# Altium schematic sheet mcu.SchDoc
size A3; SheetNumber: 5; SheetTotal: 5
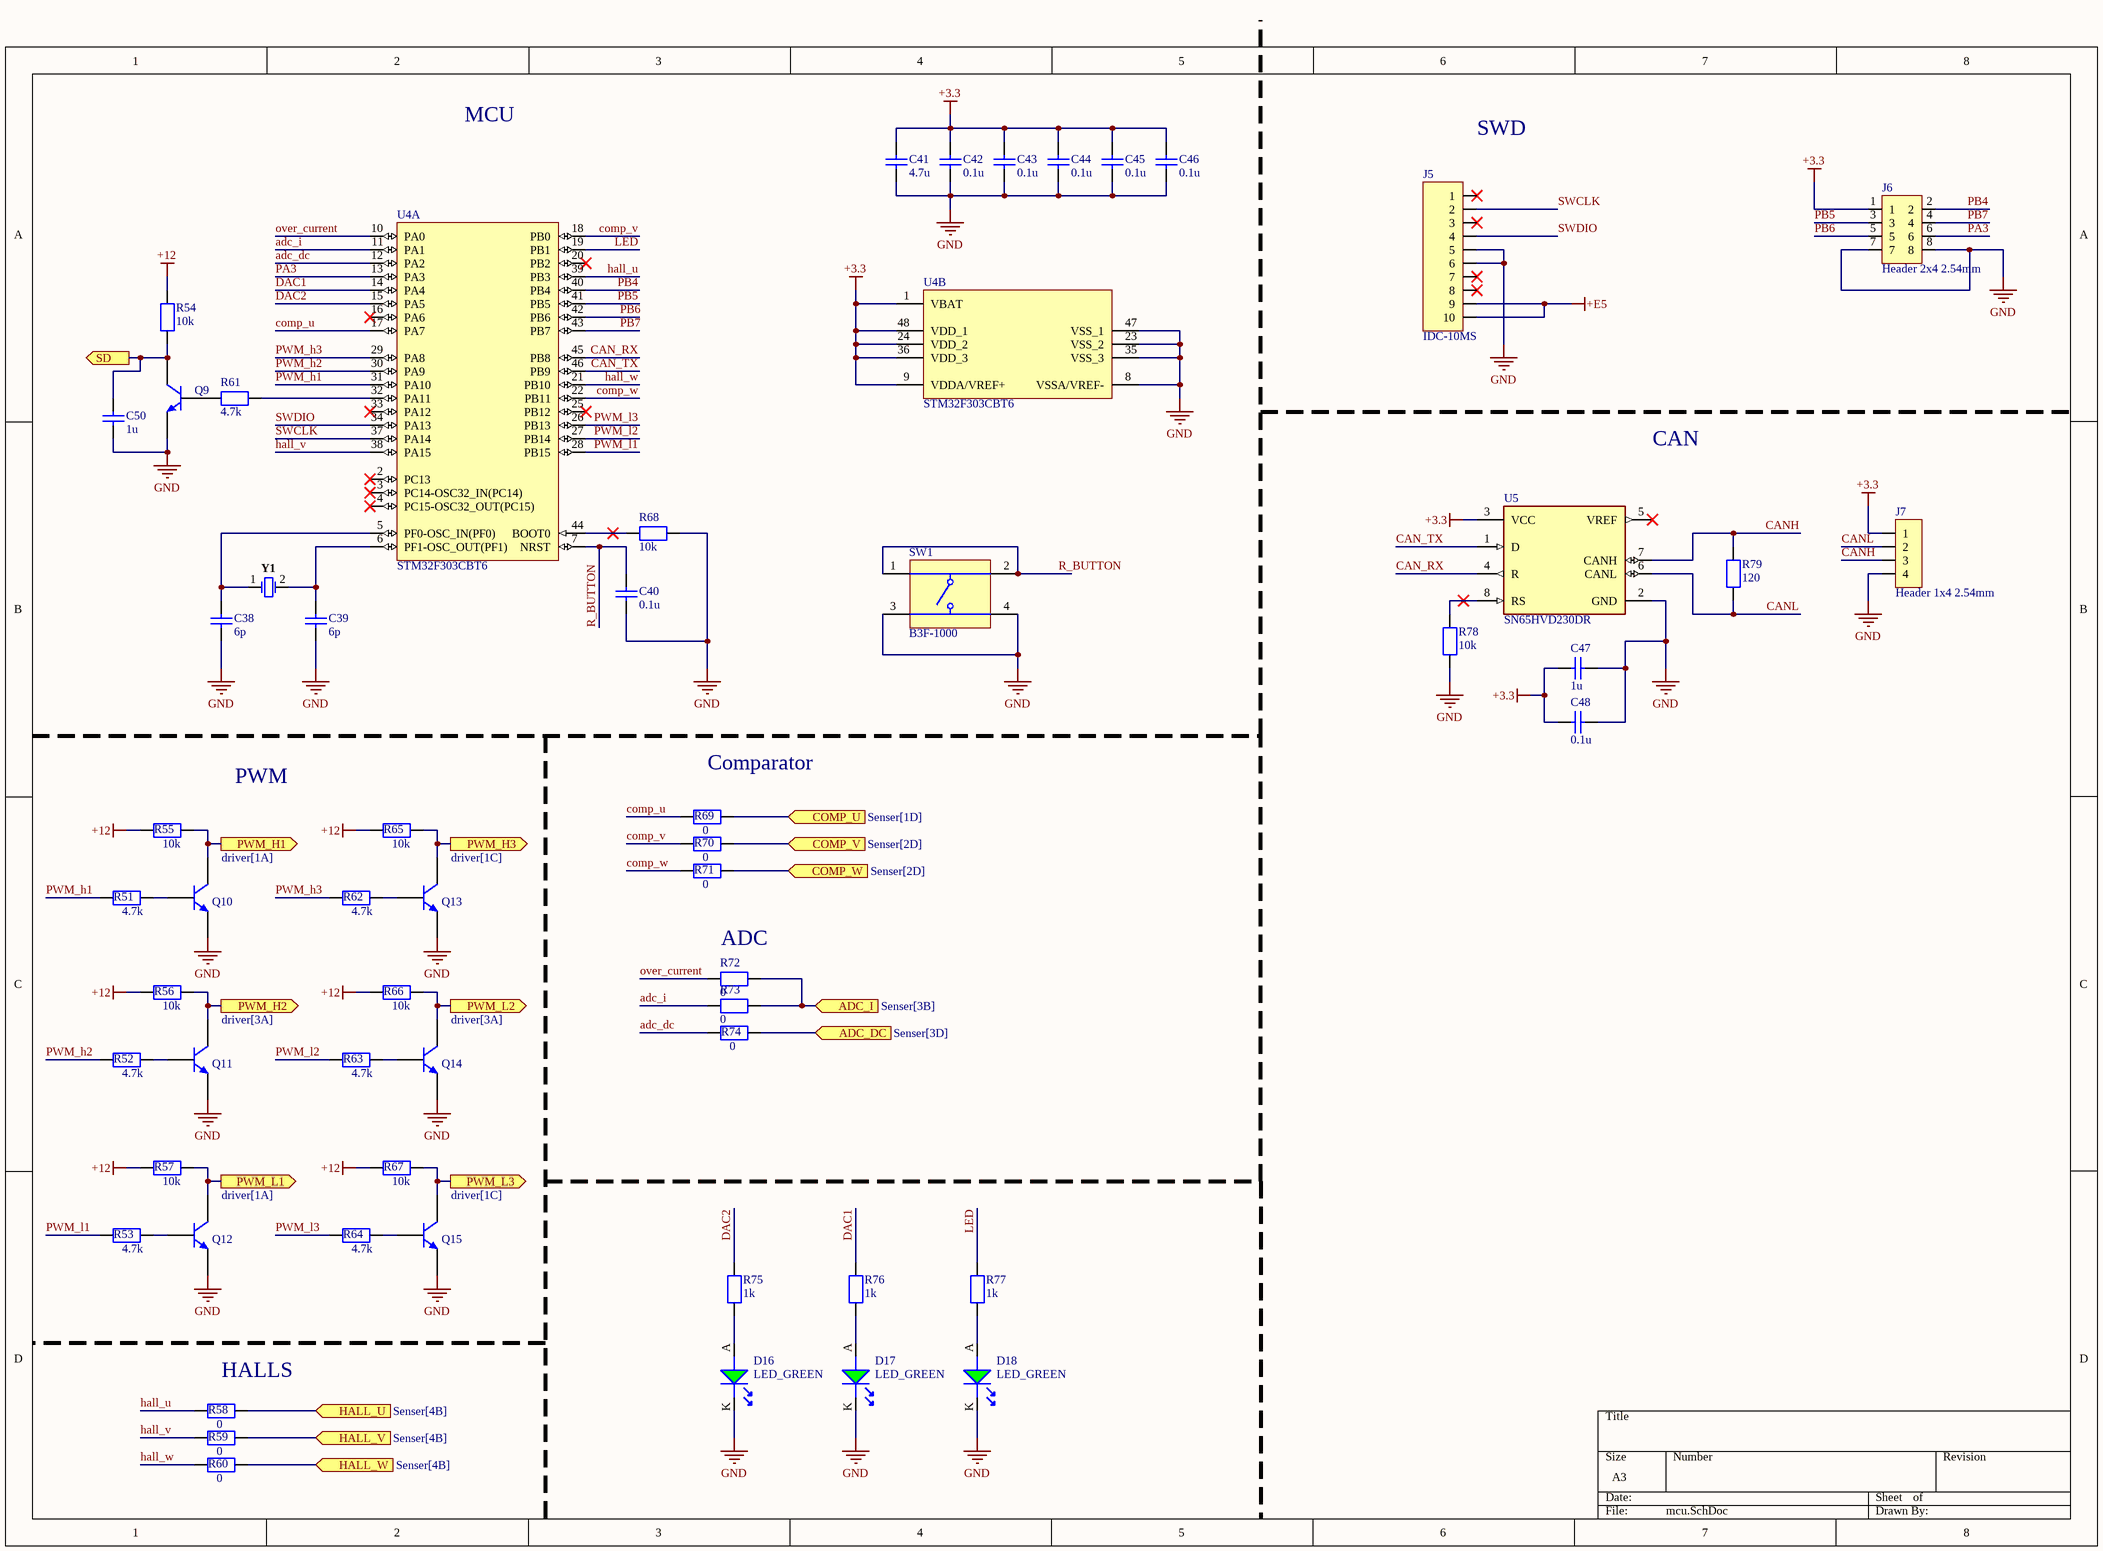
[diagram p0: mcu.SchDoc]

## Parts
C38  value 6p  [CAPC2012X06N]  (hidden comment: CAP)
C39  value 6p  [CAPC2012X06N]  (hidden comment: CAP)
C40  value 0.1u  [CAPC2012X06N]  (hidden comment: CAP)
C41  value 4.7u  [CAPC2012X06N]  (hidden comment: CAP)
C42  value 0.1u  [CAPC2012X06N]  (hidden comment: CAP)
C43  value 0.1u  [CAPC2012X06N]  (hidden comment: CAP)
C44  value 0.1u  [CAPC2012X06N]  (hidden comment: CAP)
C45  value 0.1u  [CAPC2012X06N]  (hidden comment: CAP)
C46  value 0.1u  [CAPC2012X06N]  (hidden comment: CAP)
C47  value 1u  [CAPC2012X06N]  (hidden comment: CAP)
C48  value 0.1u  [CAPC2012X06N]  (hidden comment: CAP)
C50  value 1u  [CAPC2012X06N]  (hidden comment: CAP)
D16  LED_GREEN  [LED_3216]
D17  LED_GREEN  [LED_3216]
D18  LED_GREEN  [LED_3216]
J5  IDC-10MS  [IDC-10MS]
J6  Header 2x4 2.54mm  [Header 2x4 2.54mm]
J7  Header 1x4 2.54mm  [Header 1x4 2.54mm]
Q9  NPN  [SOT23]  (value not drawn)
Q10  NPN  [SOT23]  (value not drawn)
Q11  NPN  [SOT23]  (value not drawn)
Q12  NPN  [SOT23]  (value not drawn)
Q13  NPN  [SOT23]  (value not drawn)
Q14  NPN  [SOT23]  (value not drawn)
Q15  NPN  [SOT23]  (value not drawn)
R51  value 4.7k  [RESC2012X06N]  (hidden comment: Resistor)
R52  value 4.7k  [RESC2012X06N]  (hidden comment: Resistor)
R53  value 4.7k  [RESC2012X06N]  (hidden comment: Resistor)
R54  value 10k  [RESC2012X06N]  (hidden comment: Resistor)
R55  value 10k  [RESC2012X06N]  (hidden comment: Resistor)
R56  value 10k  [RESC2012X06N]  (hidden comment: Resistor)
R57  value 10k  [RESC2012X06N]  (hidden comment: Resistor)
R58  value 0  [RESC2012X06N]  (hidden comment: Resistor)
R59  value 0  [RESC2012X06N]  (hidden comment: Resistor)
R60  value 0  [RESC2012X06N]  (hidden comment: Resistor)
R61  value 4.7k  [RESC2012X06N]  (hidden comment: Resistor)
R62  value 4.7k  [RESC2012X06N]  (hidden comment: Resistor)
R63  value 4.7k  [RESC2012X06N]  (hidden comment: Resistor)
R64  value 4.7k  [RESC2012X06N]  (hidden comment: Resistor)
R65  value 10k  [RESC2012X06N]  (hidden comment: Resistor)
R66  value 10k  [RESC2012X06N]  (hidden comment: Resistor)
R67  value 10k  [RESC2012X06N]  (hidden comment: Resistor)
R68  value 10k  [RESC2012X06N]  (hidden comment: Resistor)
R69  value 0  [RESC2012X06N]  (hidden comment: Resistor)
R70  value 0  [RESC2012X06N]  (hidden comment: Resistor)
R71  value 0  [RESC2012X06N]  (hidden comment: Resistor)
R72  value 0  [RESC2012X06N]  (hidden comment: Resistor)
R73  value 0  [RESC2012X06N]  (hidden comment: Resistor)
R74  value 0  [RESC2012X06N]  (hidden comment: Resistor)
R75  value 1k  [RESC2012X06N]  (hidden comment: Resistor)
R76  value 1k  [RESC2012X06N]  (hidden comment: Resistor)
R77  value 1k  [RESC2012X06N]  (hidden comment: Resistor)
R78  value 10k  [RESC2012X06N]  (hidden comment: Resistor)
R79  value 120  [RESC2012X06N]  (hidden comment: Resistor)
SW1  B3F-1000  [OMRON-B3F-1000-4_V]
U4  STM32F303CBT6  [STM-LQFP48_L]  (parts A,B of 2)
U5  SN65HVD230DR  [FP-D0008A-IPC_A]
Y1  NX3225GD-8MHZ-STD-CRA-3  [NDK-NX3225GD-8MHZ-STD-CRA-3_V]  (value not drawn)

## Ports
ADC_DC (in, see Senser[3D]), ADC_I (in, see Senser[3B]), COMP_U (in, see Senser[1D]), COMP_V (in, see Senser[2D]), COMP_W (in, see Senser[2D]), HALL_U (in, see Senser[4B]), HALL_V (in, see Senser[4B]), HALL_W (in, see Senser[4B]), PWM_H1 (out, see driver[1A]), PWM_H2 (out, see driver[3A]), PWM_H3 (out, see driver[1C]), PWM_L1 (out, see driver[1A]), PWM_L2 (out, see driver[3A]), PWM_L3 (out, see driver[1C]), SD (out, see driver[3C])

## Nets
+3.3: C41.1 C42.1 C43.1 C44.1 C45.1 C46.1 C47.2 C48.2 J6.1 J7.1 U4.1(VBAT) U4.9(VDDA/VREF+) U4.24(VDD_2) U4.36(VDD_3) U4.48(VDD_1) U5.3(VCC)
+12: R54.2 R55.1 R56.1 R57.1 R65.1 R66.1 R67.1
+E5: J5.9 J5.10
GND: C38.2 C39.2 C40.2 C41.2 C42.2 C43.2 C44.2 C45.2 C46.2 C47.1 C48.1 C50.2 D16.K D17.K D18.K J5.5 J5.6 J6.7 J6.8 J7.4 Q9.2(E) Q10.2(E) Q11.2(E) Q12.2(E) Q13.2(E) Q14.2(E) Q15.2(E) R68.2 R78.1 SW1.3 SW1.4 U4.8(VSSA/VREF-) U4.23(VSS_2) U4.35(VSS_3) U4.47(VSS_1) U5.2(GND)
adc_dc: R74.1 U4.12(PA2)
ADC_DC: R74.2 ; port ADC_DC  [a separate net that carries the same name]
adc_i: R73.1 U4.11(PA1)
ADC_I: R72.2 R73.2 ; port ADC_I  [a separate net that carries the same name]
CAN_RX: U4.45(PB8) U5.4(R)
CAN_TX: U4.46(PB9) U5.1(D)
CANH: J7.3 R79.2 U5.7(CANH)
CANL: J7.2 R79.1 U5.6(CANL)
comp_u: R69.1 U4.17(PA7)
COMP_U: R69.2 ; port COMP_U  [a separate net that carries the same name]
comp_v: R70.1 U4.18(PB0)
COMP_V: R70.2 ; port COMP_V  [a separate net that carries the same name]
comp_w: R71.1 U4.22(PB11)
COMP_W: R71.2 ; port COMP_W  [a separate net that carries the same name]
DAC1: R76.2 U4.14(PA4)
DAC2: R75.2 U4.15(PA5)
hall_u: R58.1 U4.39(PB3)
HALL_U: R58.2 ; port HALL_U  [a separate net that carries the same name]
hall_v: R59.1 U4.38(PA15)
HALL_V: R59.2 ; port HALL_V  [a separate net that carries the same name]
hall_w: R60.1 U4.21(PB10)
HALL_W: R60.2 ; port HALL_W  [a separate net that carries the same name]
LED: R77.2 U4.19(PB1)
over_current: R72.1 U4.10(PA0)
PA3: J6.6 U4.13(PA3)
PB4: J6.2 U4.40(PB4)
PB5: J6.3 U4.41(PB5)
PB6: J6.5 U4.42(PB6)
PB7: J6.4 U4.43(PB7)
PWM_h1: R51.1 U4.31(PA10)
PWM_H1: Q10.3(C) R55.2 ; port PWM_H1  [a separate net that carries the same name]
PWM_h2: R52.1 U4.30(PA9)
PWM_H2: Q11.3(C) R56.2 ; port PWM_H2  [a separate net that carries the same name]
PWM_h3: R62.1 U4.29(PA8)
PWM_H3: Q13.3(C) R65.2 ; port PWM_H3  [a separate net that carries the same name]
PWM_l1: R53.1 U4.28(PB15)
PWM_L1: Q12.3(C) R57.2 ; port PWM_L1  [a separate net that carries the same name]
PWM_l2: R63.1 U4.27(PB14)
PWM_L2: Q14.3(C) R66.2 ; port PWM_L2  [a separate net that carries the same name]
PWM_l3: R64.1 U4.26(PB13)
PWM_L3: Q15.3(C) R67.2 ; port PWM_L3  [a separate net that carries the same name]
R_BUTTON: C40.1 SW1.1 SW1.2 U4.7(NRST)
SD: C50.1 Q9.3(C) R54.1 ; port SD
SWCLK: J5.2 U4.37(PA14)
SWDIO: J5.4 U4.34(PA13)
NetC38_1: C38.1 U4.5(PF0-OSC_IN(PF0)) Y1.1
NetC39_1: C39.1 U4.6(PF1-OSC_OUT(PF1)) Y1.2
NetD16_A: D16.A R75.1
NetD17_A: D17.A R76.1
NetD18_A: D18.A R77.1
NetQ9_1: Q9.1(B) R61.1
NetQ10_1: Q10.1(B) R51.2
NetQ11_1: Q11.1(B) R52.2
NetQ12_1: Q12.1(B) R53.2
NetQ13_1: Q13.1(B) R62.2
NetQ14_1: Q14.1(B) R63.2
NetQ15_1: Q15.1(B) R64.2
NetR61_2: R61.2 U4.32(PA11)
NetR68_1: R68.1 U4.44(BOOT0)
NetR78_2: R78.2 U5.8(RS)

Not connected (* = marked no-connect by the designer): J5 1* 3* 7* 8*; U4 2(PC13)* 3(PC14-OSC32_IN(PC14))* 4(PC15-OSC32_OUT(PC15))* 16(PA6)* 20(PB2)* 25(PB12)* 33(PA12)*; U5 5(VREF)*

## Notes on the sheet
- MCU
- SWD
- CAN
- PWM
- (near R69) Comparator
- (near R72) ADC
- (near R58) HALLS

## Library data of the parts
C40 C42-C46 = CAP: Конденсатор керамический smd 0.1 мкФ X7R 50В 10% 0805; Source: *
C41 = CAP: Конденсатор керамический smd 4.7 мкФ X5R 10% 25В 0805; Source: *
C47 C50 = CAP: Конденсатор керамический smd 1 мкФ X7R 10% 50В 0805; Source: *
D16-D18 = LED_GREEN: TO-3216BC-BF, Светодиод синий SMD 3216
J5 = IDC-10MS: Вилка на плату прямая 2x5 2.54мм
J6 = Header 2x4
J7 = Header 1x4: PLS-4 (DS-1021-1x4), Вилка штыревая 2.54мм 1x4pin
Q9-Q15 = NPN: BC817,215, Транзистор NPN 45В 0.5А
R51-R53 R61-R64 = Resistor: 0.125Вт 0805 4.7 кОм, 1%; Source: *
R54-R57 R65-R68 R78 = Resistor: 0.125Вт 0805 10 кОм, 1%; Source: *
R58-R60 R69-R74 = Resistor: 0.125Вт 0805 (перемычка) 0 Ом, 1%; Source: *
R75-R77 = Resistor: 0.125Вт 0805 1 кОм, 1%; Source: *
R79 = Resistor: 0.125Вт 0805 120 Ом, 1%; Source: *
SW1 = CMP-011-00004-2: Tactile Switch, SPST-NO, 0.05 A, 24 V, -25 to 70 degC, 4-Pin THD, RoHS, Bulk; Manufacturer: Omron Electronic Components; Throw Configuration: SPST; Max Contact Resistance: 100mohm; Resistance: 0.1Ohm; Max Current Rating: 50mA; Voltage Rating: 24V; Operating Force: 100gf; Datasheet Version: Jan-15; Case/Package: B3F-1000; Packaging: Bulk; Package Description: 4-Pin Through Hole Device, Body 6 x 6 mm; Manufacturer URL: http://www.omron.com/; Package Reference: B3F-1000; Contact Plating: Gold; Contact Current Rating: 50mA; RoHS Compliant: True; Contact Material: Gold; Mounting Technology: TH; Max Operating Temperature: 70°C; Min Operating Temperature: -25°C; Package Quantity: 1500; Datasheet URL: http://www.omron.com/ecb/products/pdf/en-b3f.pdf; Voltage Rating (DC): 24V; Pins: 4; Current Rating: 50mA; Max Voltage Rating (DC): 24V
U4 = CMP-0572-00014-2: ARM Cortex-M4 32-bit MCU, 128 KB Flash, 32 KB Internal RAM, 37 I/Os, 48-pin LQFP, -40 to 85 degC, Tray; Internal RAM Size (kB): 32; Supply Voltage(Vcc) min (V): 2; Operating Frequency(F) (Processor speed) (MHz): 72; FLASH Size (Prog) (kB): 128; I/Os (High Current): 37; D/A Converter: 2x12-bit (2 Channel); PackageDescription: 48-Pin Low Profile Quad Flat Package, 7 x 7 mm Body, 0.5 mm Pitch; ComponentLink1URL: http://www.st.com/web/en/home.html; Packing: Tray; ComponentLink1Description: Manufacturer URL; DatasheetVersion: Rev. 6; Mounting Technology: Surface Mount; PartNumber: STM32F303CBT6; Core: ARM Cortex-M4; ComponentLink2URL: http://www.st.com/st-web-ui/static/active/en/resource/technical/document/datasheet/DM00058181.pdf; ComponentLink3URL: http://www.st.com/st-web-ui/static/active/en/resource/technical/document/datasheet/DM00058181.pdf; PackageReference: LQFP48; ComponentLink3Description: Package Specification; PackageVersion: Rev. 6, 06/2013; ComponentLink2Description: Datasheet
U5 = CMP-0315-00015-3: IC TRANSCEIVER HALF 1/1 8SOIC; Number of Transceivers: 1; Operating Supply Voltage: 3.3V; Number of I/Os: 2; Max Supply Current: 17mA; Max Supply Voltage: 3.6V; Min Supply Voltage: 3V; Data Rate: 1Mbps; Min Operating Temperature: -40°C; Packaging: Tape and Reel; Lead Free: Lead Free; Number of Transmit Buffers: 1; Max Operating Temperature: 85°C; Number of Receive Buffers: 1; Number of Pins: 8; Package Quantity: 1; Radiation Hardening: No; Case/Package: D; REACH SVHC: No SVHC; Weight: 0.002561oz; Termination: SMD/SMT; Contact Plating: Gold; Nominal Supply Current: 17mA; Number of Receivers: 1; Number of Drivers: 1
Y1 = CMP-2000-07595-1: Crystal Unit, 8 MHz, 8 pF, -40 to 150 degC, 2-Pin SMD, RoHS, Tape and Reel; Manufacturer: NDK; Load Capacitance: 8pF; ESR (Equivalent Series Resistance): 500Ohm; Frequency Tolerance: 50ppm; Frequency Stability: 150ppm; Frequency: 8MHz; Case/Package: SMD/SMT; Datasheet Version: 11/2016; Min Operating Temperature: -40degC; Packaging: TapeandReel; Width: 0.098inch; Package Quantity: 3000; Number of Pins: 2; Package Description: 2-Pin Surface Mount Device, Body 3.2 x 2.5 mm; RoHSCompliant: True; Package Reference: NX3225GD-8MHZ-STD-CRA-3; Datasheet URL: http://www.ndk.com/images/products/catalog/c_NX3225GD-STD-CRA-3_e.pdf; Mounting Technology: SurfaceMount; Length: 0.126inch; Mount: SurfaceMount; Manufacturer URL: http://www.ndk.com/en/; Max Operating Temperature: 150degC; Height: 0.039inch
C38 C39 C48 = CAP: Source: *